# Altium schematic sheet Controller.SchDoc
size A3; Organization: Altium Limited; Address1: L3, 12a Rodborough Rd; Address2: Frenchs Forest; Address3: NSW; Address4: Australia 2086
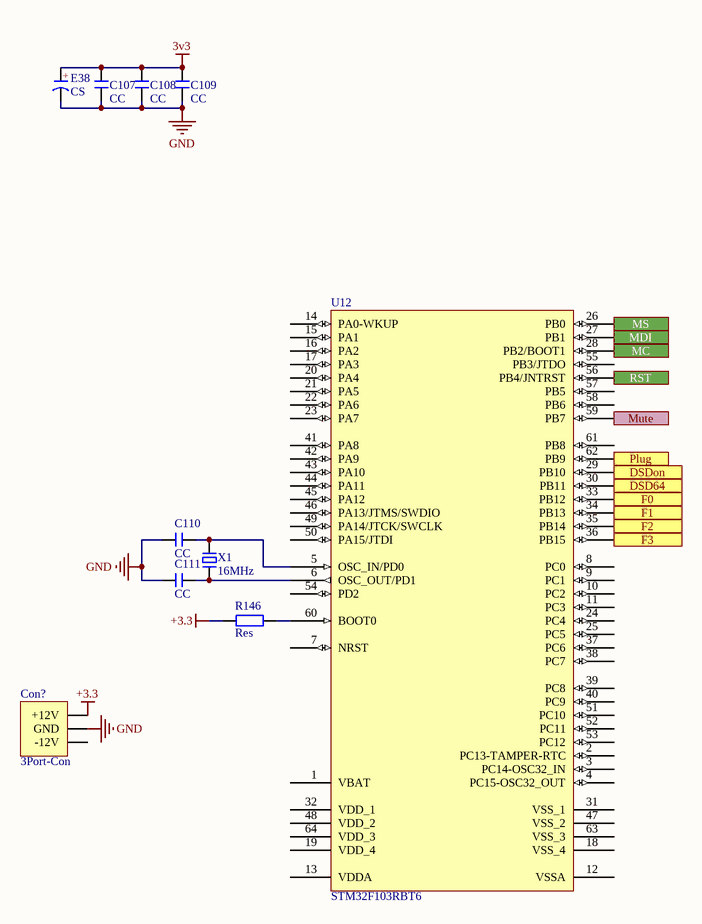
[diagram p0: Controller.SchDoc]

## Parts
C107  CC
C108  CC
C109  CC
C110  CC
C111  CC
Con?  3Port-Con
E38  CS
R146  Res
U12  STM32F103RBT6  [LQFP64_N]
X1  16MHz

## Ports
DSD64, DSDon, F0, F1, F2, F3, MC, MDI, MS, Mute, Plug, RST

## Nets
3v3: C107.1 C108.1 C109.1 E38.K
+3.3: Con?.1(+12V) R146.1
GND: C107.2 C108.2 C109.2 C110.1 C111.1 Con?.2(GND) E38.A
DSD64: U12.30(PB11) ; port DSD64
DSDon: U12.29(PB10) ; port DSDon
F0: U12.33(PB12) ; port F0
F1: U12.34(PB13) ; port F1
F2: U12.35(PB14) ; port F2
F3: U12.36(PB15) ; port F3
MC: U12.28(PB2/BOOT1) ; port MC
MDI: U12.27(PB1) ; port MDI
MS: U12.26(PB0) ; port MS
Mute: U12.59(PB7) ; port Mute
Plug: U12.62(PB9) ; port Plug
RST: U12.56(PB4/JNTRST) ; port RST
NetC110_2: C110.2 U12.5(OSC_IN/PD0) X1.2
NetC111_2: C111.2 U12.6(OSC_OUT/PD1) X1.1
NetR146_2: R146.2 U12.60(BOOT0)

Not connected (* = marked no-connect by the designer): Con? 3(-12V); U12 1(VBAT) 2(PC13-TAMPER-RTC) 3(PC14-OSC32_IN) 4(PC15-OSC32_OUT) 7(NRST) 8(PC0) 9(PC1) 10(PC2) 11(PC3) 12(VSSA) 13(VDDA) 14(PA0-WKUP) 15(PA1) 16(PA2) 17(PA3) 18(VSS_4) 19(VDD_4) 20(PA4) 21(PA5) 22(PA6) 23(PA7) 24(PC4) 25(PC5) 31(VSS_1) 32(VDD_1) 37(PC6) 38(PC7) 39(PC8) 40(PC9) 41(PA8) 42(PA9) 43(PA10) 44(PA11) 45(PA12) 46(PA13/JTMS/SWDIO) 47(VSS_2) 48(VDD_2) 49(PA14/JTCK/SWCLK) 50(PA15/JTDI) 51(PC10) 52(PC11) 53(PC12) 54(PD2) 55(PB3/JTDO) 57(PB5) 58(PB6) 61(PB8) 63(VSS_3) 64(VDD_3)

## Notes on the sheet
- Title
- Size:
- Date:
- A3
- Number:
- Time:
- Revision:
- Sheet
- of
- File:
- (in symbol CS) +

## Library data of the parts
C107-C111 = CC: 陶片电容
Con? = 3Port-Con: Dual-12V Connector
E38 = CS: 电解电容
U12 = STM32F103RBT6: STM32 ARM-based 32-bit MCU with 128 Kbytes Flash, 64-pin LQFP, Industrial Temperature; Published: 30-May-2008; DatasheetVersion: rev6, Mar-2008; PackageVersion: Mar-2008; PackageReference: LQFP64; Publisher: Altium Limited; PackageDescription: 64-Pin Low-Profile Quad Flat Pack, 10 x 10 mm Body, 0.5 mm Pitch (LQFP64); ComponentLink1Description: Manufacturer Link; ComponentLink1URL: www.st.com/stm32; ComponentLink2Description: Datasheet; ComponentLink2URL: http://www.st.com/stonline/products/literature/ds/13587.pdf
X1 = XTAL